# Altium schematic sheet optInputR.SchDoc
size 420 x 297 mm; Scale: 1:1; DocumentType: Схема электрическая принципиальная; FirstReferrence: АБВГ.123456.001
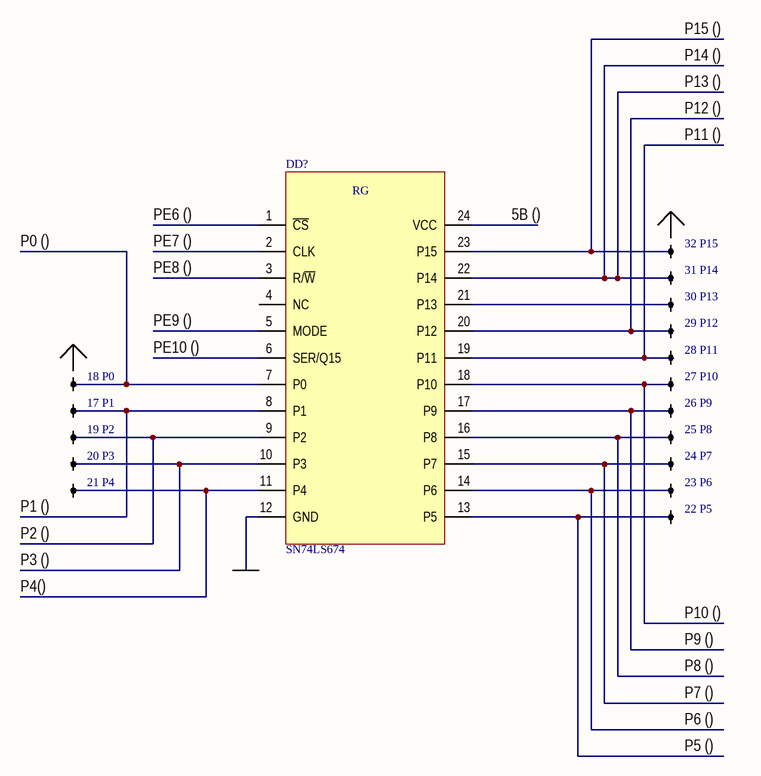
[diagram p0: optInputR.SchDoc]

## Parts
(Parts that share a designator on the sheet are numbered #1, #2 ... from top to bottom, then left to right.)
DD?  SN74LS674  [SOP127P1030X265-24N]
X?#1  32 P15  [PLD40]  (part 32 of 40)
X?#2  31 P14  [PLD40]  (part 31 of 40)
X?#3  30 P13  [PLD40]  (part 30 of 40)
X?#4  29 P12  [PLD40]  (part 29 of 40)
X?#5  28 P11  [PLD40]  (part 28 of 40)
X?#6  18 P0  [PLD40]  (part R of 40)
X?#7  27 P10  [PLD40]  (part 27 of 40)
X?#8  17 P1  [PLD40]  (part Q of 40)
X?#9  26 P9  [PLD40]  (part Z of 40)
X?#10  19 P2  [PLD40]  (part S of 40)
X?#11  25 P8  [PLD40]  (part Y of 40)
X?#12  20 P3  [PLD40]  (part T of 40)
X?#13  24 P7  [PLD40]  (part X of 40)
X?#14  21 P4  [PLD40]  (part U of 40)
X?#15  23 P6  [PLD40]  (part W of 40)
X?#16  22 P5  [PLD40]  (part V of 40)

## Nets
NetDD?_7: DD?.7(P0) X?#6.32
NetDD?_8: DD?.8(P1) X?#8.31
NetDD?_9: DD?.9(P2) X?#10.33
NetDD?_10: DD?.10(P3) X?#12.34
NetDD?_11: DD?.11(P4) X?#14.35
NetDD?_13: DD?.13(P5) X?#16.36
NetDD?_14: DD?.14(P6) X?#15.37
NetDD?_15: DD?.15(P7) X?#13.38
NetDD?_16: DD?.16(P8) X?#11.39
NetDD?_17: DD?.17(P9) X?#9.40
NetDD?_18: DD?.18(P10) X?#7.2
NetDD?_19: DD?.19(P11) X?#5.3
NetDD?_20: DD?.20(P12) X?#4.4
NetDD?_21: DD?.21(P13) X?#3.5
NetDD?_22: DD?.22(P14) X?#2.6
NetDD?_23: DD?.23(P15) X?#1.7

Not connected (* = marked no-connect by the designer): DD? 1(~{CS}) 2(CLK) 3(R/~{W}) 4(NC) 5(MODE) 6(SER/Q15) 12(GND) 24(VCC)

## Notes on the sheet
- P15 ()
- P12 ()
- P13 ()
- P14 ()
- P11 ()
- P0 ()
- PE6 ()
- PE7 ()
- 5В ()
- PE8 ()
- PE9 ()
- PE10 ()
- (near X?#14) P1 ()
- (near X?#14) P2 ()
- P3 ()
- P4()
- P9 ()
- P10 ()
- P6 ()
- P8 ()
- P7 ()
- P5 ()
- Подп. и дата
- Инв. № дубл.
- Взам. инв. №
- Инв. № подл.
- Изм.
- Лист
- № докум.
- Подп.
- Дата
- 2.106-A3
- Копировал
- Формат А3
- (in symbol SN74LS674) RG

## Library data of the parts
X?#1-X?#16 = PLD40